# Altium schematic sheet MultiChannelADC.SchDoc
size A3; SheetNumber: 9; SheetTotal: 8
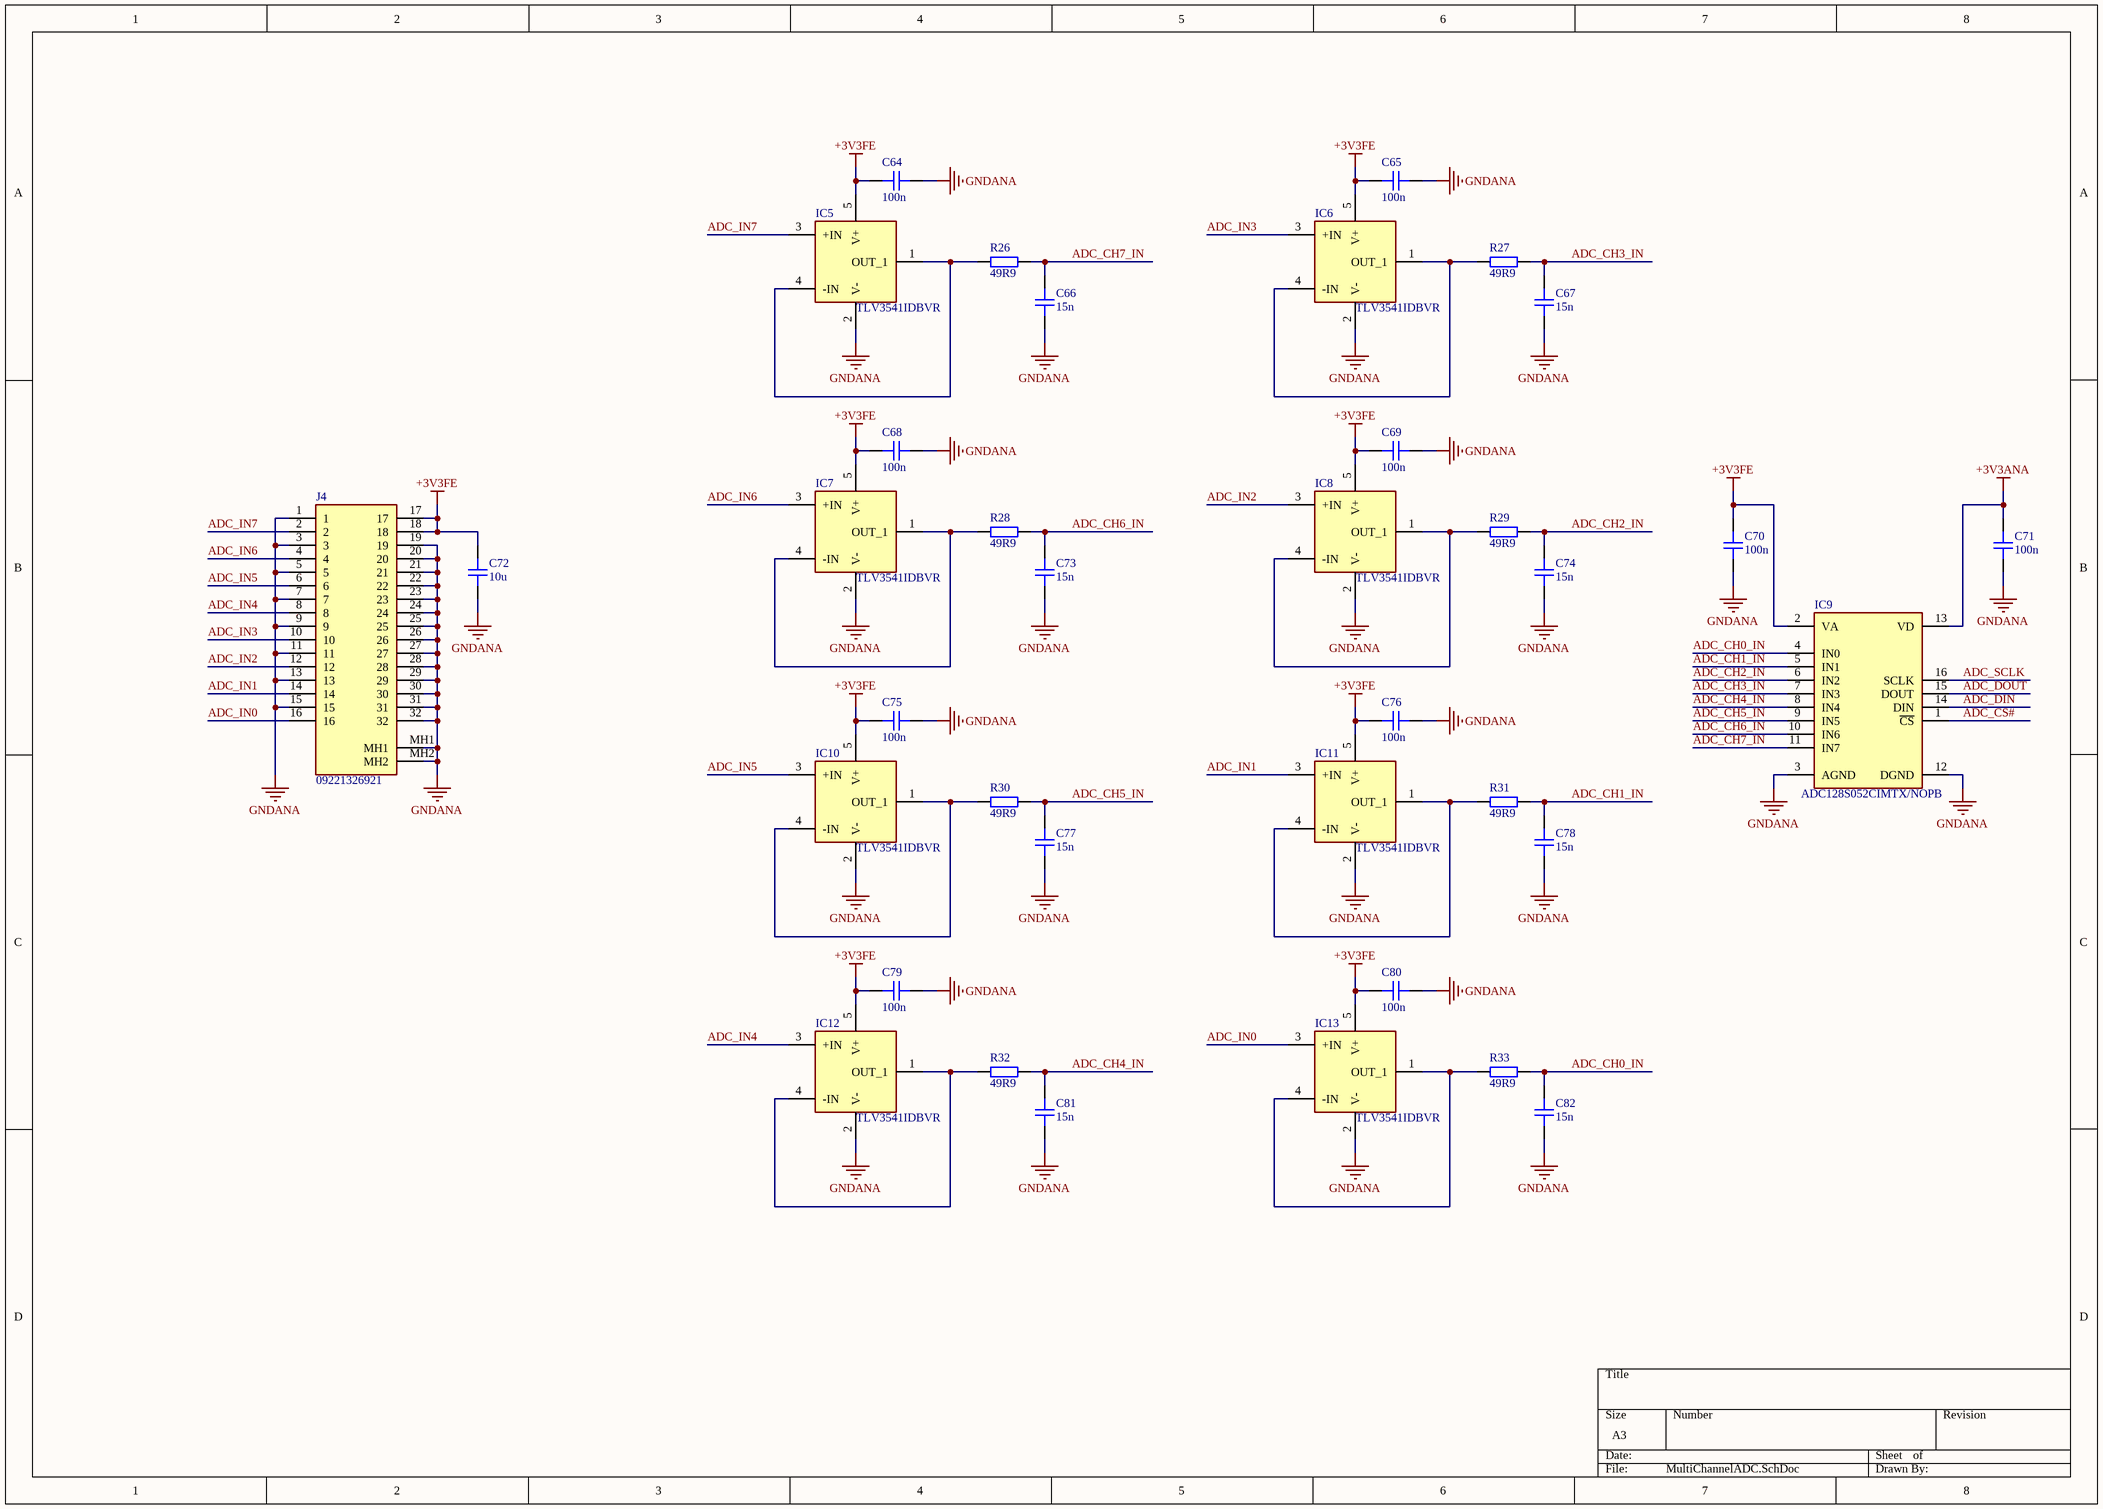
[diagram p0: MultiChannelADC.SchDoc]

## Parts
C64  100n  [CAP_0402]
C65  100n  [CAP_0402]
C66  15n  [CAP_0402]
C67  15n  [CAP_0402]
C68  100n  [CAP_0402]
C69  100n  [CAP_0402]
C70  100n  [CAP_0402]
C71  100n  [CAP_0402]
C72  10u  [CAP_0603]
C73  15n  [CAP_0402]
C74  15n  [CAP_0402]
C75  100n  [CAP_0402]
C76  100n  [CAP_0402]
C77  15n  [CAP_0402]
C78  15n  [CAP_0402]
C79  100n  [CAP_0402]
C80  100n  [CAP_0402]
C81  15n  [CAP_0402]
C82  15n  [CAP_0402]
IC5  TLV3541IDBVR  [SOT95P280X145-5N - duplicate]
IC6  TLV3541IDBVR  [SOT95P280X145-5N - duplicate]
IC7  TLV3541IDBVR  [SOT95P280X145-5N - duplicate]
IC8  TLV3541IDBVR  [SOT95P280X145-5N - duplicate]
IC9  ADC128S052CIMTX/NOPB  [SOP65P640X120-16N]
IC10  TLV3541IDBVR  [SOT95P280X145-5N - duplicate]
IC11  TLV3541IDBVR  [SOT95P280X145-5N - duplicate]
IC12  TLV3541IDBVR  [SOT95P280X145-5N - duplicate]
IC13  TLV3541IDBVR  [SOT95P280X145-5N - duplicate]
J4  09221326921  [09221326921]
R26  49R9  [RES_0402]
R27  49R9  [RES_0402]
R28  49R9  [RES_0402]
R29  49R9  [RES_0402]
R30  49R9  [RES_0402]
R31  49R9  [RES_0402]
R32  49R9  [RES_0402]
R33  49R9  [RES_0402]

## Nets
+3V3ANA: C71.2 IC9.13(VD)
+3V3FE: C64.2 C65.2 C68.2 C69.2 C70.2 C72.2 C75.2 C76.2 C79.2 C80.2 IC5.5(V+) IC6.5(V+) IC7.5(V+) IC8.5(V+) IC9.2(VA) IC10.5(V+) IC11.5(V+) IC12.5(V+) IC13.5(V+) J4.17 J4.18
GNDANA: C64.1 C65.1 C66.1 C67.1 C68.1 C69.1 C70.1 C71.1 C72.1 C73.1 C74.1 C75.1 C76.1 C77.1 C78.1 C79.1 C80.1 C81.1 C82.1 IC5.2(V-) IC6.2(V-) IC7.2(V-) IC8.2(V-) IC9.3(AGND) IC9.12(DGND) IC10.2(V-) IC11.2(V-) IC12.2(V-) IC13.2(V-) J4.1 J4.3 J4.5 J4.7 J4.9 J4.11 J4.13 J4.15 J4.19 J4.20 J4.21 J4.22 J4.23 J4.24 J4.25 J4.26 J4.27 J4.28 J4.29 J4.30 J4.31 J4.32 J4.MH1 J4.MH2
ADC_CH0_IN: C82.2 IC9.4(IN0) R33.2
ADC_CH1_IN: C78.2 IC9.5(IN1) R31.2
ADC_CH2_IN: C74.2 IC9.6(IN2) R29.2
ADC_CH3_IN: C67.2 IC9.7(IN3) R27.2
ADC_CH4_IN: C81.2 IC9.8(IN4) R32.2
ADC_CH5_IN: C77.2 IC9.9(IN5) R30.2
ADC_CH6_IN: C73.2 IC9.10(IN6) R28.2
ADC_CH7_IN: C66.2 IC9.11(IN7) R26.2
ADC_CS#: IC9.1(~{CS})
ADC_DIN: IC9.14(DIN)
ADC_DOUT: IC9.15(DOUT)
ADC_IN0: IC13.3(+IN) J4.16
ADC_IN1: IC11.3(+IN) J4.14
ADC_IN2: IC8.3(+IN) J4.12
ADC_IN3: IC6.3(+IN) J4.10
ADC_IN4: IC12.3(+IN) J4.8
ADC_IN5: IC10.3(+IN) J4.6
ADC_IN6: IC7.3(+IN) J4.4
ADC_IN7: IC5.3(+IN) J4.2
ADC_SCLK: IC9.16(SCLK)
NetIC5_1: IC5.1(OUT_1) IC5.4(-IN) R26.1
NetIC6_1: IC6.1(OUT_1) IC6.4(-IN) R27.1
NetIC7_1: IC7.1(OUT_1) IC7.4(-IN) R28.1
NetIC8_1: IC8.1(OUT_1) IC8.4(-IN) R29.1
NetIC10_1: IC10.1(OUT_1) IC10.4(-IN) R30.1
NetIC11_1: IC11.1(OUT_1) IC11.4(-IN) R31.1
NetIC12_1: IC12.1(OUT_1) IC12.4(-IN) R32.1
NetIC13_1: IC13.1(OUT_1) IC13.4(-IN) R33.1

## Library data of the parts
C64-C71 C73-C82 = CAP_0402: Capacitor SMD 0402; Manufacturer: *; Manufacturer Part Number: *; Distributor Link: *; LCSC: *; Rating: *; Dielectric: *
C72 = CAP_0603: Capacitor SMD 0603; Manufacturer: *; Manufacturer Part Number: *; Distributor Link: *; LCSC: *; Rating: *; Dielectric: *
IC5-IC8 IC10-IC13 = TLV3541IDBVR: Integrated Circuit; Manufacturer_Name: Texas Instruments; Datasheet Link: http://www.ti.com/lit/gpn/tlv3541; Height: 1.45mm; Manufacturer_Part_Number: TLV3541IDBVR; Mouser Part Number: 595-TLV3541IDBVR; Mouser Price/Stock: https://www.mouser.co.uk/ProductDetail/Texas-Instruments/TLV3541IDBVR?qs=9lcNTSmDlCoQ%2FjlOWHAJGw%3D%3D; Arrow Part Number: TLV3541IDBVR; Arrow Price/Stock: https://www.arrow.com/en/products/tlv3541idbvr/texas-instruments?region=nac
IC9 = ADC128S052CIMTX/NOPB: Texas Instruments 8 Channel A/D-Converter 500 kSP/S; Datasheet Link: http://www.ti.com/lit/ds/symlink/adc128s052.pdf; Height: 1.2mm; Manufacturer_Name: Texas Instruments; Manufacturer_Part_Number: ADC128S052CIMTX/NOPB; Mouser Part Number: 926-A128S052CIMTXNPB; Mouser Price/Stock: https://www.mouser.com/Search/Refine.aspx?Keyword=926-A128S052CIMTXNPB; Arrow Part Number: ADC128S052CIMTX/NOPB; Arrow Price/Stock: https://www.arrow.com/en/products/adc128s052cimtxnopb/texas-instruments
J4 = 09221326921: Connector; Manufacturer_Name: HARTING; Datasheet Link: https://b2b.harting.com/files/download/PRD/PDF_DS/PDF_DS_09031200201.pdf; Height: 8.5mm; Manufacturer_Part_Number: 09221326921; Mouser Part Number: 617-09-22-132-6921; Mouser Price/Stock: https://www.mouser.co.uk/ProductDetail/HARTING/09221326921?qs=qa49y27LPCH2CheOb1uPAg%3D%3D; Arrow Part Number: 09221326921; Arrow Price/Stock: https://www.arrow.com/en/products/09221326921/harting?region=nac
R26-R33 = RES_0402: Resistor SMD 0402; Manufacturer: *; Manufacturer Part Number: *; Distributor Link: *; LCSC: *